# EAGLE design Schematic (EAGLE 6.3)
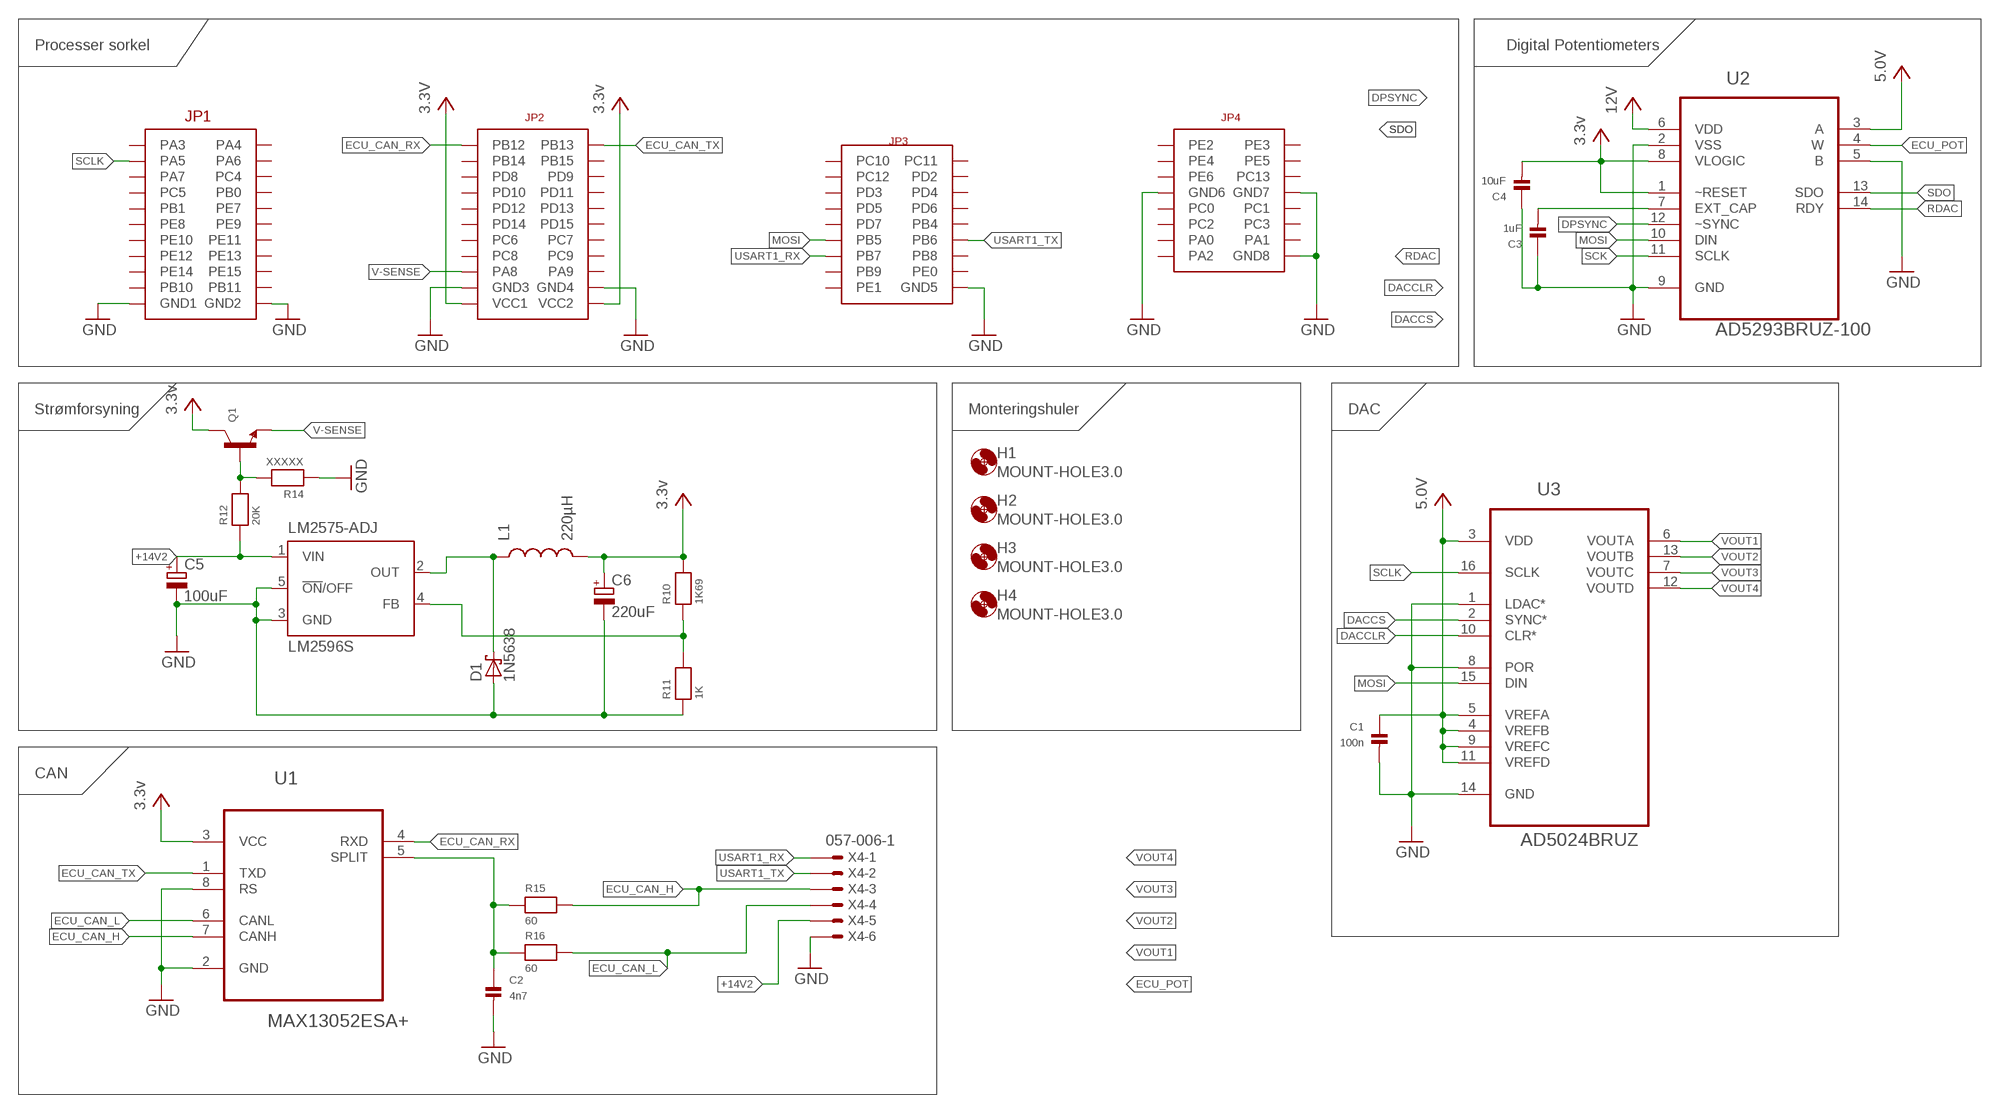
[diagram p0: schematic, sheet 1]

## Parts
C1  100n  CAP_CERAMIC_0603  [_0603]
C2  4n7  CAP_CERAMIC0603  [0603]
C3  1uF  CAP_CERAMIC0603  [0603]
C4  10uF  CAP_CERAMIC0603  [0603]
C5  100uF  CPOL-EUE15-5AXIAL  [E15-5]
C6  220uF  CPOL-EUE15-5AXIAL  [E15-5]
D1  1N5638  [DO13M]
H1  MOUNT-HOLE3.0  [3,0]
H2  MOUNT-HOLE3.0  [3,0]
H3  MOUNT-HOLE3.0  [3,0]
H4  MOUNT-HOLE3.0  [3,0]
L1  220µH  INDUCTORPWR  [CDRH125]
LM2575-ADJ  LM2596S  [TO263-5]
Q1  TRANSISTOR_NPNWIDE  [SOT23-WIDE]
R10  1K69  RESISTOR_0603  [_0603]
R11  1K  RESISTOR_0603  [_0603]
R12  20K  RESISTOR_0603  [_0603]
R14  XXXXX  RESISTOR_0603  [_0603]
R15  60  RESISTOR_0603  [_0603]
R16  60  RESISTOR_0603  [_0603]
U1  MAX13052ESA+  [SOIC127P600X175-8N]
U2  AD5293BRUZ-100  [SOP65P640X120-14N]
U3  AD5024BRUZ  [SOP65P640X120-16N]
U$1  CPU-BOARD  [CPU-BOARD-JP1]
X4  057-006-1  [057-006-1]

## Nets
+14V2: C5.+ LM2575-ADJ.1(VIN) R12.1 X4.5
DACCLR: U3.10(CLR*)
DACCS: U3.2(SYNC*)
DPSYNC: U2.12(~SYNC)
ECU_CAN_H: R15.2 U1.7(CANH) X4.3
ECU_CAN_L: R16.2 U1.6(CANL) X4.4
ECU_CAN_RX: U1.4(RXD) U$1.P$23(PB12)
ECU_CAN_TX: U1.1(TXD) U$1.P$24(PB13)
ECU_POT: U2.4(W)
GND: C1.2 C2.2 C3.1 C4.1 C5.- C6.- D1.A LM2575-ADJ.3(GND) LM2575-ADJ.5(!ON!/OFF) R11.1 R14.1 U1.2(GND) U1.8(RS) U2.2(VSS) U2.5(B) U2.9(GND) U3.1(LDAC*) U3.8(POR) U3.14(GND) U$1.P$20(GND2) U$1.P$41(GND3) U$1.P$42(GND4) U$1.P$62(GND5) U$1.P$69(GND6) U$1.P$70(GND7) U$1.P$78(GND8) X4.6
MOSI: U2.10(DIN) U3.15(DIN) U$1.P$55(PB5)
N$1: C3.2 U2.7(EXT_CAP)
N$10: D1.C L1.1 LM2575-ADJ.2(OUT)
N$13: LM2575-ADJ.4(FB) R10.1 R11.2
N$14: Q1.1(B) R12.2 R14.2
N$21: C2.1 R15.1 R16.1 U1.5(SPLIT)
PE: U$1.P$19(GND1) ; supply symbol labelled GND
RDAC: U2.14(RDY)
SCK: U2.11(SCLK)
SCLK: U3.16(SCLK) U$1.P$3(PA5)
SDO: U2.13(SDO)
USART1_RX: U$1.P$57(PB7) X4.1
USART1_TX: U$1.P$56(PB6) X4.2
V-SENSE: Q1.2(E) U$1.P$39(PA8)
VCC: C1.1 C4.2 C6.+ L1.2 Q1.3(C) R10.2 U1.3(VCC) U2.1(~RESET) U2.3(A) U2.6(VDD) U2.8(VLOGIC) U3.3(VDD) U3.4(VREFB) U3.5(VREFA) U3.9(VREFC) U3.11(VREFD) U$1.P$43(VCC1) U$1.P$44(VCC2) ; supply symbol labelled 3.3v, 3.3V, 5.0V, 12V
VOUT1: U3.6(VOUTA)
VOUT2: U3.13(VOUTB)
VOUT3: U3.7(VOUTC)
VOUT4: U3.12(VOUTD)
Unconnected: U$1.P$1(PA3) U$1.P$2(PA4) U$1.P$4(PA6) U$1.P$5(PA7) U$1.P$6(PC4) U$1.P$7(PC5) U$1.P$8(PB0) U$1.P$9(PB1) U$1.P$10(PE7) U$1.P$11(PE8) U$1.P$12(PE9) U$1.P$13(PE10) U$1.P$14(PE11) U$1.P$15(PE12) U$1.P$16(PE13) U$1.P$17(PE14) U$1.P$18(PE15) U$1.P$21(PB10) U$1.P$22(PB11) U$1.P$25(PB14) U$1.P$26(PB15) U$1.P$27(PD8) U$1.P$28(PD9) U$1.P$29(PD10) U$1.P$30(PD11) U$1.P$31(PD12) U$1.P$32(PD13) U$1.P$33(PD14) U$1.P$34(PD15) U$1.P$35(PC6) U$1.P$36(PC7) U$1.P$37(PC8) U$1.P$38(PC9) U$1.P$40(PA9) U$1.P$45(PC10) U$1.P$46(PC11) U$1.P$47(PC12) U$1.P$48(PD2) U$1.P$49(PD3) U$1.P$50(PD4) U$1.P$51(PD5) U$1.P$52(PD6) U$1.P$53(PD7) U$1.P$54(PB4) U$1.P$58(PB8) U$1.P$59(PB9) U$1.P$60(PE0) U$1.P$61(PE1) U$1.P$63(PE2) U$1.P$64(PE3) U$1.P$65(PE4) U$1.P$66(PE5) U$1.P$67(PE6) U$1.P$68(PC13) U$1.P$71(PC0) U$1.P$72(PC1) U$1.P$73(PC2) U$1.P$74(PC3) U$1.P$75(PA0) U$1.P$76(PA1) U$1.P$77(PA2)

## Notes on the sheet
- Processer sorkel | Digital Potentiometers
- Strømforsyning | Monteringshuler | DAC
- CAN

## Library data of the parts
C1-C4 = microbuilder:CAP_CERAMIC: Ceramic Capacitors 0402 - 0402 Surface Mount Capacitors 16pF 50V 5% [Digikey: 445-4899-2-ND] 18pF 50V 5% [Digikey: 490-1281-2-ND] 22pF 50V 5% [Digikey: 490-1283-2-ND] 68pF 50V 5% [Digikey: 490-1289-2-ND] 0.1uF 10V 10% [Digikey: 490-1318-2-ND] 1.0uF 6.3V 10% [Digikey: 490-1320-2-ND] 0603 - 0603 Surface Mount Capacitors 16 pF 50V 5% [Digikey: 445-5051-2-ND] 22 pF 50V [Digikey: PCC220ACVTR-ND] 33 pF 50V 5% [Digikey: 490-1415-1-ND] 56pF 50V 5% [Digikey: 490-1421-1-ND] 220pF 50V 5% [Digikey: 445-1285-1-ND] 680 pF 50V 2200 pF 50V 5% C0G [Digikey: 445-1297-1-ND] 5600 pF 100V 5% X7R [Digikey: 478-3711-1-ND] 0.1 µF 25V 10% [Digikey: PCC2277TR-ND] 0.22 µF 16V 10% X7R [Digikey: 445-1318-1-ND] 1.0 µF 25V 10% [Digikey: 445-5146-2-ND] 0603 - RF Specific 3pF 250V +/-0.1pF RF [Digikey: 712-1347-1-ND] 18 pF 250V 5% [Digikey: 478-3505-1-ND or 712-1322-1-ND] 56 pF 250V 5% C0G RF [Digikey: 490-4867-1-ND] 68 pF 250V RF [Digikey: 490-4868-1-ND] 0805 - 0805 Surface Mount Capacitors 220 pF 250V 2% RF Ceramic Capacitor [Digikey: 712-1398-1-ND] 1000 pF 50V 2% NP0 Ceramic Capacitor [Digikey: 478-3760-1-ND] 0.1 µF 25V 10% Ceramic Capacitor [Digikey: PCC1828TR-ND] 1.0 µF 16V 10% Ceramic Capacitor[Digikey: 490-1691-2-ND] 10.0 µF 10V 10% Ceramic Capacitor[Digikey: 709-1228-1-ND] 10.0 uF 16V 10% Ceramic Capacitor [Digikey: 478-5165-2-ND] 47 uF 6.3V 20% Ceramic Capacitor [Digikey: 587-1779-1-ND or 399-5506-1-ND] 1206 - 1206 Surface Mount Capacitors 47uF 10V 20% Ceramic Capacitor [Digikey: 490-5528-1-ND or 399-5508-1-ND or 445-6010-1-ND] 100uF 6.3V -20%, +80% Y5V Ceramic Capacitor (Digikey: 490-4512-1-ND, Mouser: 81-GRM31CF50J107ZE1L)
C5 C6 = rcl:CPOL-EU: POLARIZED CAPACITOR, European symbol
D1 = diode:1N5638: DIODE schottky
H1-H4 = holes:MOUNT-HOLE: MOUNTING HOLE with drill center marker
L1 = SparkFun-Passives:INDUCTOR: Inductors Basic Inductor/Choke - 0603 and 1206. Footprints are not proven and vary greatly between part numbers. SRN6045- 33uH, 20% 1.4A SDR0403-560KL - 56uH, 10%, 500mA RMS/740mA peak
LM2575-ADJ = national-semiconductor:LM2596: SIMPLE SWITCHER® Power Converter 150 kHz 3A Step-Down Voltage Regulator Source: http://www.national.com/ds/LM/LM2596.pdf; MF: NATIONAL SEMICONDUCTOR; MPN: LM2596S-ADJ/NOPB; OC_FARNELL: 9494367; OC_NEWARK: 41K3842
Q1 = microbuilder:TRANSISTOR_NPN: NPN Transistor Transistor (NPN) 500mA 45V - BC817 [Digikey: 568-1631-1-ND] Transistor (NPN) 500mA 45V - BC817,215 [Mouser: 771-BC817-T/R] SOT23-R - SOT23 footprint optimised for use with solder paste and reflow ovens. SOT23-W - SOT23 footprint optimised for hand-soldering (larger pads).
R10-R12 R14-R16 = microbuilder:RESISTOR: Resistors 0402 - 0402 Surface Mount Package 22 Ohm 1% 1/16W [Digikey: 311-22.0LRTR-ND] 33 Ohm 5% 1/16W 1.0K 5% 1/16W 1.5K 5% 1/16W 2.0K 1% 1/16W 10.0K 1% 1/16W [Digikey: 311-10.0KLRTR-ND] 10.0K 5% 1/16W [Digikey: RMCF0402JT10K0TR-ND] 12.1K 1% 1/16W [Digikey: 311-22.0LRTR-ND] 100.0K 5% 1/16W 0603 - 0603 Surface Mount Package 0 Ohm 1/10 Watt 1% Resistor 15 Ohm 1/10 Watt 1% Resistor 33 Ohm 1/10 Watt 1% Resistor 49.9 Ohm 1/10 Watt 1% Resistor 100 Ohm 1/10 Watt 1% Resistor 150 Ohm 1/10 Watt 1% Resistor 240 Ohm 1/10 Watt 1% Resistor 390 Ohm 1/10 Watt 1% Resistor 560 Ohm 1/10 Watt 1% Resistor 680 Ohm 1/10 Watt 1% Resistor 750 Ohm 1/10 Watt 1% Resistor 1.0K Ohm 1/10 Watt 1% Resistor 1.5K Ohm 1/10 Watt 1% Resistor 2.0K Ohm 1/10 Watt 1% Resistor 2.2K Ohm 1/10 Watt 1% Resistor 3.3K Ohm 1/10 Watt 1% Resistor 4.7K Ohm 1/10 Watt 1% Resistor 10.0K Ohm 1/10 Watt 1% Resistor 12.0K Ohm 1/10 Watt 1% Resistor 12.1K Ohm 1/10 Watt 1% Resistor 20.0K Ohm 1/10 Watt 1% Resistor 33.0K Ohm 1/10 Watt 1% Resistor 100.0K Ohm 1/10 Watt 1% Resistor 0805 - 0805 Surface Mount Package 0 Ohm 1/8 Watt 1% Resistor 33 Ohm 1/8 Watt 1% Resistor 100 Ohm 1/8 Watt 1% Resistor 150 Ohm 1/8 Watt 1% Resistor 200 Ohm 1/8 Watt 1% Resistor 240 Ohm 1/8 Watt 1% Resistor 330 Ohm 1/8 Watt 1% Resistor 390 Ohm 1/8 Watt 1% Resistor 470 Ohm 1/8 Watt 1% Resistor 1.0K Ohm 1/8 Watt 1% Resistor 1.5K Ohm 1/8 Watt 1% Resistor 2.0K Ohm 1/8 Watt 1% Resistor 4.7K Ohm 1/8 Watt 1% Resistor 5.1K Ohm 1/8 Watt 1% Resistor 5.6K Ohm 1/8 Watt 1% Resistor 10.0K Ohm 1/8 Watt 1% Resistor 22.0K Ohm 1/8 Watt 1% Resistor 33.0K Ohm 1/8 Watt 1% Resistor 100K Ohm 1/8 Watt 1% Resistor 1206 - 1206 Surface Mount Package 2012 - 2010 Surface Mount Package 0.11 Ohm 1/2 Watt 1% Resistor - Digikey: RHM.11UCT-ND
U1 = Maxim_By_element14_Batch_1:MAX13052ESA+: Industry-Standard High-Speed CAN Transceivers with ±80V Fault Protection; MPN: MAX13052ESA+; OC_FARNELL: 1600112; OC_NEWARK: 99K2875; PACKAGE: SOIC-8; SUPPLIER: Maxim
U2 = AAU-Racing:AD5293BRUZ-100: Digital Potentiometers; MPN: AD5293BRUZ-100; OC_FARNELL: -; OC_NEWARK: 52R8122; PACKAGE: TSSOP-14; SUPPLIER: Analog Devices
U3 = AAU-Racing:AD5024BRUZ: 12BIT Digital-to-Analog Converters; MPN: AD5024BRUZ; OC_FARNELL: 2067817; OC_NEWARK: 07P8929; PACKAGE: TSSOP-16; SUPPLIER: Analog Devices
U$1 = unicorn_v2:CPU-BOARD
X4 = con-panduit:057-006-: CONNECTOR 6-pin series 057 contact pc board low profile headers; OC_FARNELL: unknown; OC_NEWARK: unknown

## Board
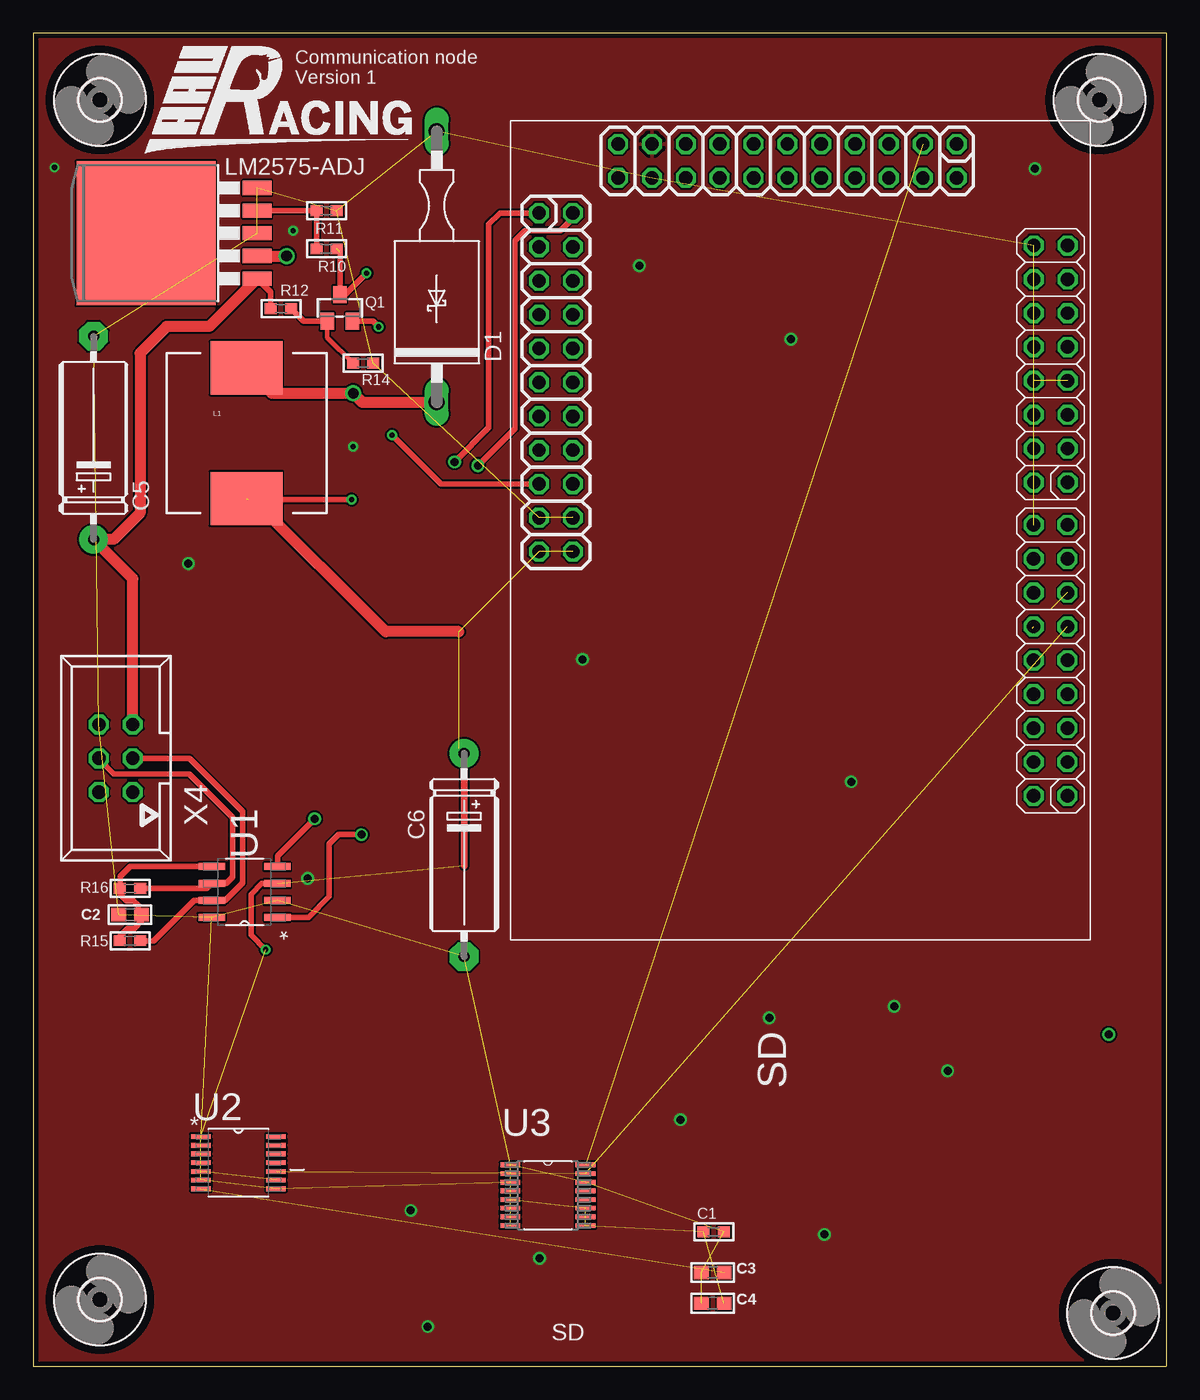
[diagram p1: board, top side]
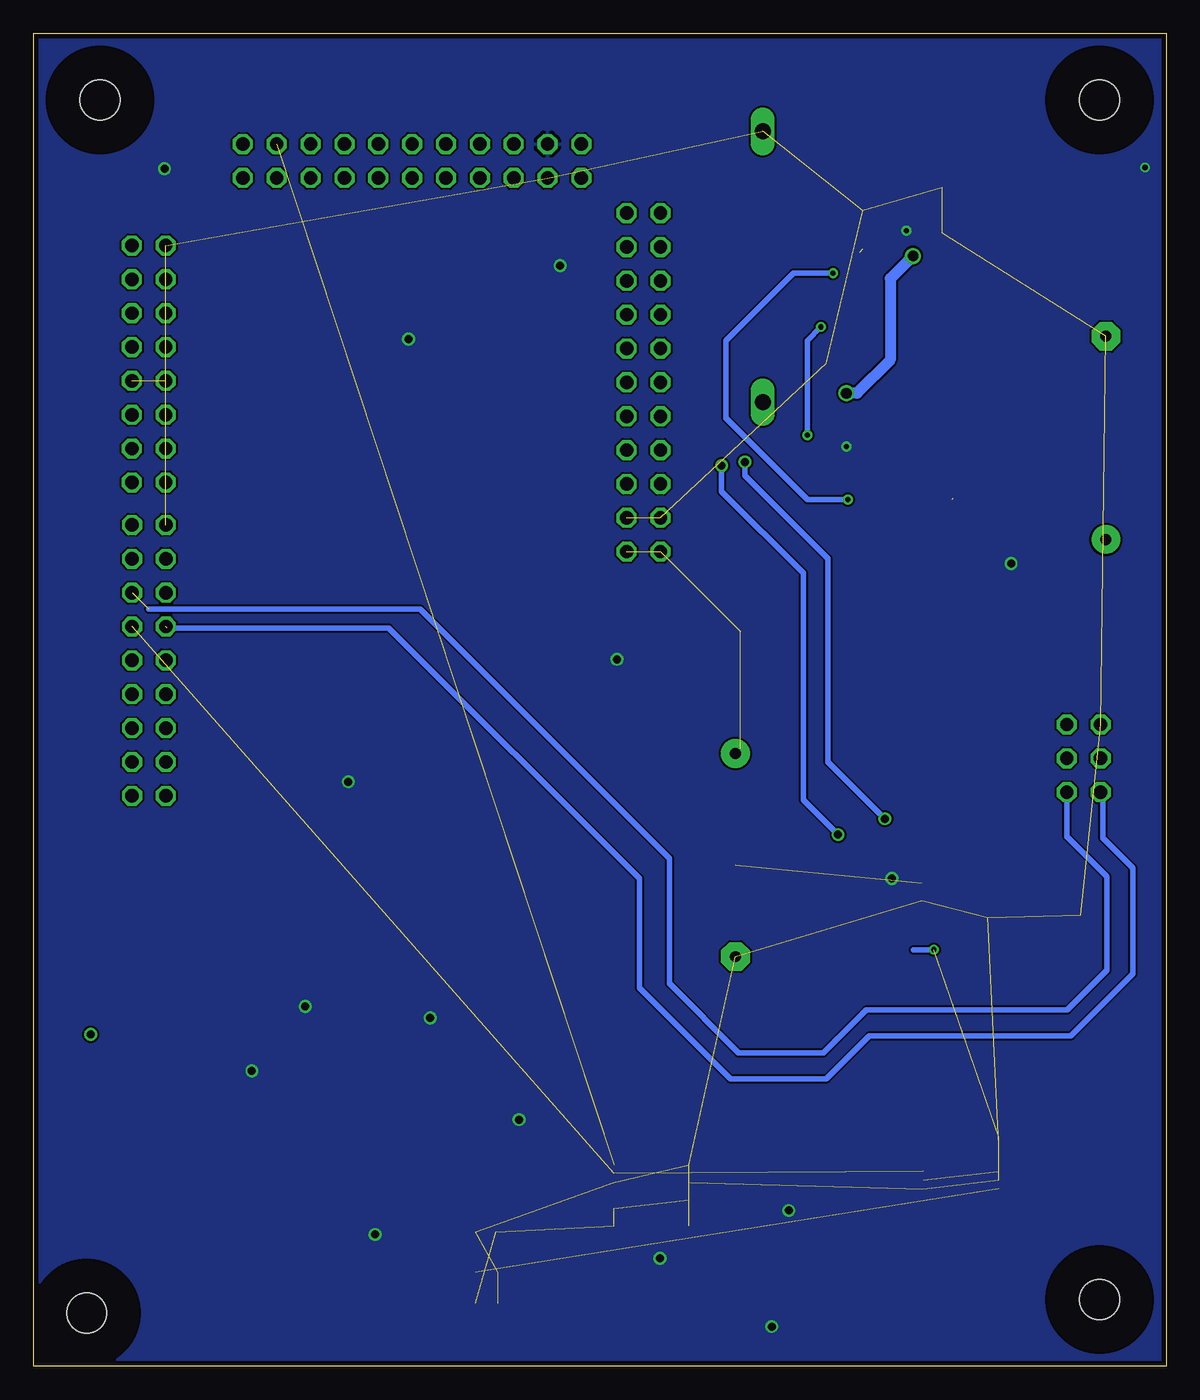
[diagram p2: board, bottom side, seen from below]

Size 85 x 100 mm. Coordinates in mm from the lower left corner, seen from the top.
Outline: 0,0 85,0 85,100 0,100 0,0
Copper layers (1*16): Top 0.0356mm / dielectric 1.5011mm / Bottom 0.0356mm
Design rules "LaenPCBOrder": minimum track width 6mil, minimum drill 13mil, track to track 6mil, track to pad 6mil, pad to pad 6mil, via to via 6mil, smd to smd 6mil, copper to edge 15mil, drill to drill 6mil, minimum pad ring 7mil, minimum via ring 7mil, stop-mask expansion 3mil, vias tented up to drill 0mil, thermal gap 10mil

### Footprints (pad centres in the part's own frame; a part is rotated, then mirrored left to right if it is on the bottom)
_0603 = smd 0.9 x 0.8: 1 -0.762,0; 2 0.762,0
0603 = smd 1.1 x 1: 1 -0.85,0; 2 0.85,0
E15-5 = drill 0.813 pad 2.159: + -7.62,0 | drill 0.813 pad 2.159 octagon: - 7.62,0
DO13M = drill 1.194 long: A 10.16,0; C -10.16,0
3,0 = hole 3: 0,0
CDRH125 = smd 5.4 x 4: 1 0,4.9; 2 0,-4.9
TO263-5 = smd 1.067 x 2.159: 1 -3.404,-5.791; 2 -1.702,-5.791; 3 0,-5.791; 4 1.702,-5.791; 5 3.404,-5.791 | smd 10.8 x 10.41: 6 0,2.54
SOT23-WIDE = smd 1 x 1.27: 1 -0.95,-1; 2 0.95,-1; 3 0,1
SOIC127P600X175-8N = smd 1.981 x 0.533: 1 -2.464,1.905; 2 -2.464,0.635; 3 -2.464,-0.635; 4 -2.464,-1.905; 5 2.464,-1.905; 6 2.464,-0.635; 7 2.464,0.635; 8 2.464,1.905
SOP65P640X120-14N = smd 1.473 x 0.356: 1 -2.819,1.956; 2 -2.819,1.295; 3 -2.819,0.66; 4 -2.819,0; 5 -2.819,-0.66; 6 -2.819,-1.295; 7 -2.819,-1.956; 8 2.819,-1.956; 9 2.819,-1.295; 10 2.819,-0.66; 11 2.819,0; 12 2.819,0.66; 13 2.819,1.295; 14 2.819,1.956
SOP65P640X120-16N = smd 1.473 x 0.356: 1 -2.819,2.286; 2 -2.819,1.626; 3 -2.819,0.965; 4 -2.819,0.33; 5 -2.819,-0.33; 6 -2.819,-0.965; 7 -2.819,-1.626; 8 -2.819,-2.286; 9 2.819,-2.286; 10 2.819,-1.626; 11 2.819,-0.965; 12 2.819,-0.33; 13 2.819,0.33; 14 2.819,0.965; 15 2.819,1.626; 16 2.819,2.286
CPU-BOARD-JP1 = drill 1 octagon: P$1 1.27,-12.7; P$2 -1.27,-12.7; P$3 1.27,-10.16; P$4 -1.27,-10.16; P$5 1.27,-7.62; P$6 -1.27,-7.62; P$7 1.27,-5.08; P$8 -1.27,-5.08; P$9 1.27,-2.54; P$10 -1.27,-2.54; P$11 1.27,0; P$12 -1.27,0; P$13 1.27,2.54; P$14 -1.27,2.54; P$15 1.27,5.08; P$16 -1.27,5.08; P$17 1.27,7.62; P$18 -1.27,7.62; P$19 1.27,10.16; P$20 -1.27,10.16; P$21 1.27,12.7; P$22 -1.27,12.7; P$23 -3.905,18.637; P$24 -3.905,16.097; P$25 -6.445,18.637; P$26 -6.445,16.097; P$27 -8.985,18.637; P$28 -8.985,16.097; P$29 -11.525,18.637; P$30 -11.525,16.097; P$31 -14.065,18.637; P$32 -14.065,16.097; P$33 -16.605,18.637; P$34 -16.605,16.097; P$35 -19.145,18.637; P$36 -19.145,16.097; P$37 -21.685,18.637; P$38 -21.685,16.097; P$39 -24.225,18.637; P$40 -24.225,16.097; P$41 -26.765,18.637; P$42 -26.765,16.097; P$43 -29.305,18.637; P$44 -29.305,16.097; P$45 -47.625,-21.018; P$46 -47.625,-18.479; P$47 -45.085,-21.018; P$48 -45.085,-18.479; P$49 -42.545,-21.018; P$50 -42.545,-18.479; P$51 -40.005,-21.018; P$52 -40.005,-18.479; P$53 -37.465,-21.018; P$54 -37.465,-18.479; P$55 -34.925,-21.018; P$56 -34.925,-18.479; P$57 -32.385,-21.018; P$58 -32.385,-18.479; P$59 -29.845,-21.018; P$60 -29.845,-18.479; P$61 -27.305,-21.018; P$62 -27.305,-18.479; P$63 -24.115,-21.024; P$64 -24.115,-18.484; P$65 -21.575,-21.024; P$66 -21.575,-18.484; P$67 -19.035,-21.024; P$68 -19.035,-18.484; P$69 -16.495,-21.024; P$70 -16.495,-18.484; P$71 -13.955,-21.024; P$72 -13.955,-18.484; P$73 -11.415,-21.024; P$74 -11.415,-18.484; P$75 -8.875,-21.024; P$76 -8.875,-18.484; P$77 -6.335,-21.024; P$78 -6.335,-18.484
057-006-1 = drill 1 octagon: 1 -2.54,-1.27; 2 -2.54,1.27; 3 0,-1.27; 4 0,1.27; 5 2.54,-1.27; 6 2.54,1.27

### Placement (x,y rotation side)
C1  51.05,10.08 0 top
C2  7.26,33.87 180 top
C3  50.98,7.04 0 top
C4  50.98,4.72 0 top
C5  4.52,69.65 90 top
C6  32.32,38.35 270 top
D1  30.27,82.49 90 top
H1  81,4 0 top
H2  5,5 0 top
H3  5,95 0 top
H4  80,95 0 top
L1  16,70 0 top
LM2575-ADJ  11,85 90 top
Q1  23,79.4 0 top
R10  22,83.83 0 top
R11  22,86.7 180 top
R12  18.58,79.34 0 top
R14  24.74,75.25 180 top
R15  7.26,31.92 0 top
R16  7.26,35.84 0 top
U1  15.85,35.58 180 top
U2  15.39,15.27 0 top
U3  38.61,12.83 0 top
U$1  56.58,90.42 90 top
X4  6.19,45.61 90 top

### Tracks (layer width: path | path; a pad name or v marks a point on that pad's centre or on a via)
+14V2
  Top 0.406: LM2575-ADJ.1 17.82,80.57 R12.1
  Top 0.813: LM2575-ADJ.1 13.19,78 10,78 8,76 8,64 6.03,62.03 C5.+ 7.46,59.09 X4.5
ECU_CAN_H
  Top 0.406: R15.2 9.03,31.92 12.06,34.95 U1.7 14.4,34.95 15.72,36.27 15.72,41.63 11.74,45.61 X4.3
ECU_CAN_L
  Top 0.406: R16.2 13.01,35.84 U1.6 14.48,36.22 14.96,36.7 14.96,41.17 11.68,44.45 6.04,44.45 4.92,45.58 X4.4
ECU_CAN_RX  (via drill 0.6)
  Top 0.406: U$1.P$23 35,86.52 34.16,85.67 34.16,70.41 v31.6,67.84 | v21.11,41.07 18.31,38.28 U1.4
  Bottom 0.406: v31.6,67.84 31.6,66.83 25.38,60.6 25.38,45.34 v21.11,41.07
ECU_CAN_TX  (via drill 0.6)
  Top 0.406: U$1.P$24 40.48,86.13 39.55,85.19 36.91,85.19 36.14,84.43 36.14,70.36 v33.35,67.56 | v24.61,39.88 22.91,39.88 22.2,39.17 22.2,35.23 20.65,33.68 U1.1
  Bottom 0.406: v33.35,67.56 33.35,65.63 27.23,59.51 27.23,42.49 v24.61,39.88
GND  (26 unrouted)
MOSI  (2 unrouted)
N$1  (1 unrouted)
N$10  (via drill 0.8)
  Top 0.813: LM2575-ADJ.2 v19,83.3 | D1.C 24.67,72.33 v24,73 17.9,73 L1.1
  Bottom 0.813: v19,83.3 20.7,81.6 20.7,75.5 23.2,73 v24,73
N$13
  Top 0.356: LM2575-ADJ.4
  Top 0.406: LM2575-ADJ.4 R11.2 R10.1
N$14
  Top 0.356: R14.2 22.05,77.18 Q1.1
  Top 0.406: R12.2 20.28,78.4 Q1.1
N$20  (via drill 0.6)
  other vias: 80.7,24.89
N$21
  Top 0.406: U1.5 7.28,37.49 6.53,36.73 6.53,35.87 | 6.53,35.87 R16.1 | 6.53,35.87 6.53,35.41 7.01,34.93 7.54,34.93 7.87,34.6 7.87,34.11 C2.1 8.11,33.36 7.59,32.84 7.09,32.84 6.5,32.25 R15.1
PE  (via drill 0.38, 0.6)
  other vias: 28.32,11.68 37.97,8.1 29.59,2.97 59.36,9.88 48.56,18.49 55.22,26.14 64.59,27 68.61,22.15 61.37,43.84 20.57,36.6 11.63,60.22 41.2,53.04 24,69 19.5,85.2 75.16,89.84 56.85,77.06 45.47,82.58 1.59,89.94
  pour Bottom: 0,0 85.09,0 85.09,100.08 0,100.08
  pour Top: 0,0 85.09,0 85.09,100.08 0,100.08
SCLK  (1 unrouted)
USART1_RX  (1 unrouted)
  Bottom 0.406: X4.1 7.46,39.74 4.47,36.75 4.47,29.69 7.42,26.75 22.5,26.75 25.73,23.52 32.11,23.52 37.29,28.7 37.29,38.1 55.98,56.79 76.36,56.79
USART1_TX  (1 unrouted)
  Bottom 0.406: X4.2 4.75,42.9 4.75,39.62 2.51,37.39 2.51,29.41 7.16,24.77 22.28,24.77 25.5,21.54 32.69,21.54 39.52,28.37 39.52,36.58 58.34,55.4 74.96,55.4
V-SENSE  (via drill 0.38)
  Top 0.406: Q1.2 25.49,78.4 v25.91,77.98 | v26.92,69.85 30.58,66.19 U$1.P$39
  Bottom 0.406: v25.91,77.98 26.92,76.96 v26.92,69.85
VCC  (via drill 0.38)  (17 unrouted)
  Top 0.305: Q1.3 23.38,80.4 | 16.51,65.02 16.08,65.02
  Top 0.406: U1.3 17.14,36.22 16.33,35.41 16.33,32.34 v17.42,31.25 | 23,83.59 Q1.3 | 23.38,80.4 v24.99,82.02 | v23.88,65.02 16.51,65.02
  Top 0.508: C6.+ 32.32,37.56
  Top 0.813: 31.93,46.36 C6.+ | 31.93,55.1 26.43,55.1 16.51,65.02
  Bottom 0.406: v17.42,31.25 18.96,31.25 | v24.99,82.02 27.97,82.02 33.02,76.96 33.02,71.12 26.92,65.02 v23.88,65.02

### Text on the board
tPlace: SD | SD
_tsilk: Communication node / Version 1